# Altium schematic sheet LPDDR4 SDRAM_2.SchDoc: RK3399 COB Design V1.0
size A3; Author: ABC; Organization: Altium Limited; Address1: L3, 12a Rodborough Rd; Address2: Frenchs Forest; Address3: NSW; Address4: Australia 2086; DocumentNumber: 6; SheetNumber: 6; SheetTotal: 27; PROJECT CODE: A_V1.0
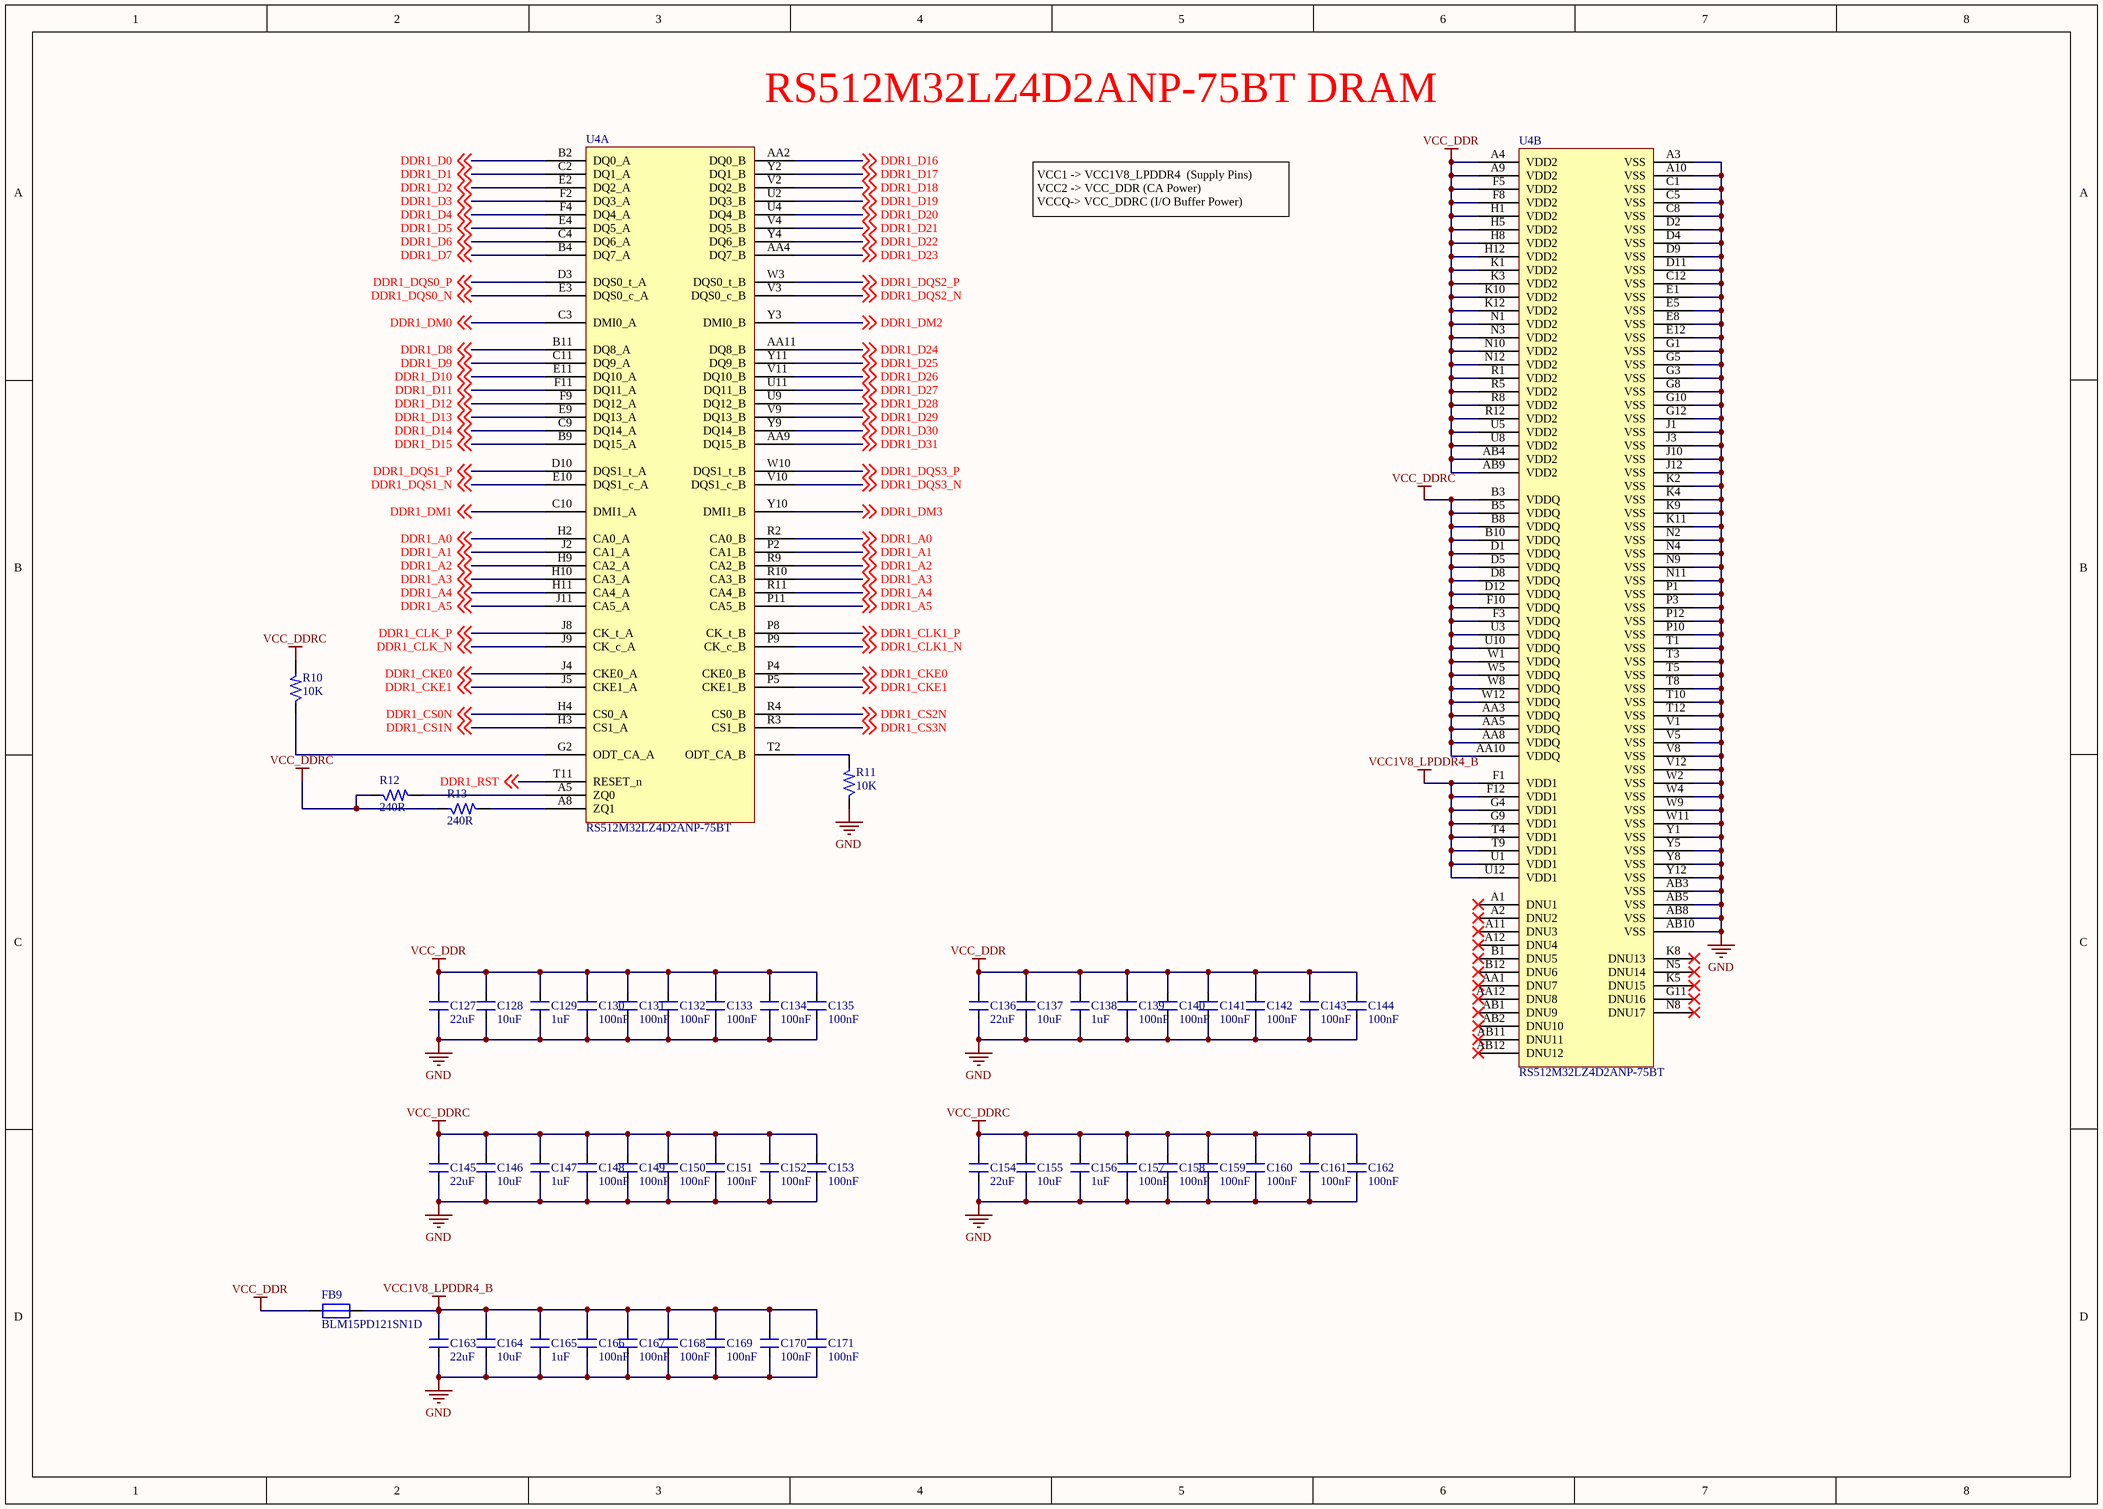
[diagram p0: LPDDR4 SDRAM_2.SchDoc]

## Parts
C127  22uF  [CAP_0402]
C128  10uF  [CAP_0402]
C129  1uF  [CAP_0201]
C130  100nF  [CAP_0201]
C131  100nF  [CAP_0201]
C132  100nF  [CAP_0201]
C133  100nF  [CAP_0201]
C134  100nF  [CAP_0201]
C135  100nF  [CAP_0201]
C136  22uF  [CAP_0402]
C137  10uF  [CAP_0402]
C138  1uF  [CAP_0201]
C139  100nF  [CAP_0201]
C140  100nF  [CAP_0201]
C141  100nF  [CAP_0201]
C142  100nF  [CAP_0201]
C143  100nF  [CAP_0201]
C144  100nF  [CAP_0201]
C145  22uF  [CAP_0402]
C146  10uF  [CAP_0402]
C147  1uF  [CAP_0201]
C148  100nF  [CAP_0201]
C149  100nF  [CAP_0201]
C150  100nF  [CAP_0201]
C151  100nF  [CAP_0201]
C152  100nF  [CAP_0201]
C153  100nF  [CAP_0201]
C154  22uF  [CAP_0402]
C155  10uF  [CAP_0402]
C156  1uF  [CAP_0201]
C157  100nF  [CAP_0201]
C158  100nF  [CAP_0201]
C159  100nF  [CAP_0201]
C160  100nF  [CAP_0201]
C161  100nF  [CAP_0201]
C162  100nF  [CAP_0201]
C163  22uF  [CAP_0402]
C164  10uF  [CAP_0402]
C165  1uF  [CAP_0201]
C166  100nF  [CAP_0201]
C167  100nF  [CAP_0201]
C168  100nF  [CAP_0201]
C169  100nF  [CAP_0201]
C170  100nF  [CAP_0201]
C171  100nF  [CAP_0201]
FB9  BLM15PD121SN1D  [RES_0402]
R10  10K  [RES_0201]
R11  10K  [RES_0201]
R12  240R  [RES_0201]
R13  240R  [RES_0201]
U4  RS512M32LZ4D2ANP-75BT  [FBGA200_SMD]  (parts A,B of 2)

## Nets
GND: C127.1 C128.1 C129.1 C130.1 C131.1 C132.1 C133.1 C134.1 C135.1 C136.1 C137.1 C138.1 C139.1 C140.1 C141.1 C142.1 C143.1 C144.1 C145.1 C146.1 C147.1 C148.1 C149.1 C150.1 C151.1 C152.1 C153.1 C154.1 C155.1 C156.1 C157.1 C158.1 C159.1 C160.1 C161.1 C162.1 C163.1 C164.1 C165.1 C166.1 C167.1 C168.1 C169.1 C170.1 C171.1 R11.1 U4.A3(VSS) U4.A10(VSS) U4.AB3(VSS) U4.AB5(VSS) U4.AB8(VSS) U4.AB10(VSS) U4.C1(VSS) U4.C5(VSS) U4.C8(VSS) U4.C12(VSS) U4.D2(VSS) U4.D4(VSS) U4.D9(VSS) U4.D11(VSS) U4.E1(VSS) U4.E5(VSS) U4.E8(VSS) U4.E12(VSS) U4.G1(VSS) U4.G3(VSS) U4.G5(VSS) U4.G8(VSS) U4.G10(VSS) U4.G12(VSS) U4.J1(VSS) U4.J3(VSS) U4.J10(VSS) U4.J12(VSS) U4.K2(VSS) U4.K4(VSS) U4.K9(VSS) U4.K11(VSS) U4.N2(VSS) U4.N4(VSS) U4.N9(VSS) U4.N11(VSS) U4.P1(VSS) U4.P3(VSS) U4.P10(VSS) U4.P12(VSS) U4.T1(VSS) U4.T3(VSS) U4.T5(VSS) U4.T8(VSS) U4.T10(VSS) U4.T12(VSS) U4.V1(VSS) U4.V5(VSS) U4.V8(VSS) U4.V12(VSS) U4.W2(VSS) U4.W4(VSS) U4.W9(VSS) U4.W11(VSS) U4.Y1(VSS) U4.Y5(VSS) U4.Y8(VSS) U4.Y12(VSS)
VCC1V8_LPDDR4_B: C163.2 C164.2 C165.2 C166.2 C167.2 C168.2 C169.2 C170.2 C171.2 FB9.2 U4.F1(VDD1) U4.F12(VDD1) U4.G4(VDD1) U4.G9(VDD1) U4.T4(VDD1) U4.T9(VDD1) U4.U1(VDD1) U4.U12(VDD1)
VCC_DDR: C127.2 C128.2 C129.2 C130.2 C131.2 C132.2 C133.2 C134.2 C135.2 C136.2 C137.2 C138.2 C139.2 C140.2 C141.2 C142.2 C143.2 C144.2 FB9.1 U4.A4(VDD2) U4.A9(VDD2) U4.AB4(VDD2) U4.AB9(VDD2) U4.F5(VDD2) U4.F8(VDD2) U4.H1(VDD2) U4.H5(VDD2) U4.H8(VDD2) U4.H12(VDD2) U4.K1(VDD2) U4.K3(VDD2) U4.K10(VDD2) U4.K12(VDD2) U4.N1(VDD2) U4.N3(VDD2) U4.N10(VDD2) U4.N12(VDD2) U4.R1(VDD2) U4.R5(VDD2) U4.R8(VDD2) U4.R12(VDD2) U4.U5(VDD2) U4.U8(VDD2)
VCC_DDRC: C145.2 C146.2 C147.2 C148.2 C149.2 C150.2 C151.2 C152.2 C153.2 C154.2 C155.2 C156.2 C157.2 C158.2 C159.2 C160.2 C161.2 C162.2 R10.2 R12.1 R13.1 U4.AA3(VDDQ) U4.AA5(VDDQ) U4.AA8(VDDQ) U4.AA10(VDDQ) U4.B3(VDDQ) U4.B5(VDDQ) U4.B8(VDDQ) U4.B10(VDDQ) U4.D1(VDDQ) U4.D5(VDDQ) U4.D8(VDDQ) U4.D12(VDDQ) U4.F3(VDDQ) U4.F10(VDDQ) U4.U3(VDDQ) U4.U10(VDDQ) U4.W1(VDDQ) U4.W5(VDDQ) U4.W8(VDDQ) U4.W12(VDDQ)
DDR1_A0: U4.H2(CA0_A) U4.R2(CA0_B) ; off-sheet DDR1_A0
DDR1_A1: U4.J2(CA1_A) U4.P2(CA1_B) ; off-sheet DDR1_A1
DDR1_A2: U4.H9(CA2_A) U4.R9(CA2_B) ; off-sheet DDR1_A2
DDR1_A3: U4.H10(CA3_A) U4.R10(CA3_B) ; off-sheet DDR1_A3
DDR1_A4: U4.H11(CA4_A) U4.R11(CA4_B) ; off-sheet DDR1_A4
DDR1_A5: U4.J11(CA5_A) U4.P11(CA5_B) ; off-sheet DDR1_A5
DDR1_CKE0: U4.J4(CKE0_A) U4.P4(CKE0_B) ; off-sheet DDR1_CKE0
DDR1_CKE1: U4.J5(CKE1_A) U4.P5(CKE1_B) ; off-sheet DDR1_CKE1
DDR1_CLK1_N: U4.P9(CK_c_B) ; off-sheet DDR1_CLK1_N
DDR1_CLK1_P: U4.P8(CK_t_B) ; off-sheet DDR1_CLK1_P
DDR1_CLK_N: U4.J9(CK_c_A) ; off-sheet DDR1_CLK_N
DDR1_CLK_P: U4.J8(CK_t_A) ; off-sheet DDR1_CLK_P
DDR1_CS0N: U4.H4(CS0_A) ; off-sheet DDR1_CS0N
DDR1_CS1N: U4.H3(CS1_A) ; off-sheet DDR1_CS1N
DDR1_CS2N: U4.R4(CS0_B) ; off-sheet DDR1_CS2N
DDR1_CS3N: U4.R3(CS1_B) ; off-sheet DDR1_CS3N
DDR1_D0: U4.B2(DQ0_A) ; off-sheet DDR1_D0
DDR1_D1: U4.C2(DQ1_A) ; off-sheet DDR1_D1
DDR1_D2: U4.E2(DQ2_A) ; off-sheet DDR1_D2
DDR1_D3: U4.F2(DQ3_A) ; off-sheet DDR1_D3
DDR1_D4: U4.F4(DQ4_A) ; off-sheet DDR1_D4
DDR1_D5: U4.E4(DQ5_A) ; off-sheet DDR1_D5
DDR1_D6: U4.C4(DQ6_A) ; off-sheet DDR1_D6
DDR1_D7: U4.B4(DQ7_A) ; off-sheet DDR1_D7
DDR1_D8: U4.B11(DQ8_A) ; off-sheet DDR1_D8
DDR1_D9: U4.C11(DQ9_A) ; off-sheet DDR1_D9
DDR1_D10: U4.E11(DQ10_A) ; off-sheet DDR1_D10
DDR1_D11: U4.F11(DQ11_A) ; off-sheet DDR1_D11
DDR1_D12: U4.F9(DQ12_A) ; off-sheet DDR1_D12
DDR1_D13: U4.E9(DQ13_A) ; off-sheet DDR1_D13
DDR1_D14: U4.C9(DQ14_A) ; off-sheet DDR1_D14
DDR1_D15: U4.B9(DQ15_A) ; off-sheet DDR1_D15
DDR1_D16: U4.AA2(DQ0_B) ; off-sheet DDR1_D16
DDR1_D17: U4.Y2(DQ1_B) ; off-sheet DDR1_D17
DDR1_D18: U4.V2(DQ2_B) ; off-sheet DDR1_D18
DDR1_D19: U4.U2(DQ3_B) ; off-sheet DDR1_D19
DDR1_D20: U4.U4(DQ4_B) ; off-sheet DDR1_D20
DDR1_D21: U4.V4(DQ5_B) ; off-sheet DDR1_D21
DDR1_D22: U4.Y4(DQ6_B) ; off-sheet DDR1_D22
DDR1_D23: U4.AA4(DQ7_B) ; off-sheet DDR1_D23
DDR1_D24: U4.AA11(DQ8_B) ; off-sheet DDR1_D24
DDR1_D25: U4.Y11(DQ9_B) ; off-sheet DDR1_D25
DDR1_D26: U4.V11(DQ10_B) ; off-sheet DDR1_D26
DDR1_D27: U4.U11(DQ11_B) ; off-sheet DDR1_D27
DDR1_D28: U4.U9(DQ12_B) ; off-sheet DDR1_D28
DDR1_D29: U4.V9(DQ13_B) ; off-sheet DDR1_D29
DDR1_D30: U4.Y9(DQ14_B) ; off-sheet DDR1_D30
DDR1_D31: U4.AA9(DQ15_B) ; off-sheet DDR1_D31
DDR1_DM0: U4.C3(DMI0_A) ; off-sheet DDR1_DM0
DDR1_DM1: U4.C10(DMI1_A) ; off-sheet DDR1_DM1
DDR1_DM2: U4.Y3(DMI0_B) ; off-sheet DDR1_DM2
DDR1_DM3: U4.Y10(DMI1_B) ; off-sheet DDR1_DM3
DDR1_DQS0_N: U4.E3(DQS0_c_A) ; off-sheet DDR1_DQS0_N
DDR1_DQS0_P: U4.D3(DQS0_t_A) ; off-sheet DDR1_DQS0_P
DDR1_DQS1_N: U4.E10(DQS1_c_A) ; off-sheet DDR1_DQS1_N
DDR1_DQS1_P: U4.D10(DQS1_t_A) ; off-sheet DDR1_DQS1_P
DDR1_DQS2_N: U4.V3(DQS0_c_B) ; off-sheet DDR1_DQS2_N
DDR1_DQS2_P: U4.W3(DQS0_t_B) ; off-sheet DDR1_DQS2_P
DDR1_DQS3_N: U4.V10(DQS1_c_B) ; off-sheet DDR1_DQS3_N
DDR1_DQS3_P: U4.W10(DQS1_t_B) ; off-sheet DDR1_DQS3_P
DDR1_RST: U4.T11(RESET_n) ; off-sheet DDR1_RST
NetR10_1: R10.1 U4.G2(ODT_CA_A)
NetR11_2: R11.2 U4.T2(ODT_CA_B)
NetR12_2: R12.2 U4.A5(ZQ0)
NetR13_2: R13.2 U4.A8(ZQ1)

Not connected (* = marked no-connect by the designer): U4 A1(DNU1)* A2(DNU2)* A11(DNU3)* A12(DNU4)* AA1(DNU7)* AA12(DNU8)* AB1(DNU9)* AB2(DNU10)* AB11(DNU11)* AB12(DNU12)* B1(DNU5)* B12(DNU6)* G11(DNU16)* K5(DNU15)* K8(DNU13)* N5(DNU14)* N8(DNU17)*

## Notes on the sheet
- (near U4) RS512M32LZ4D2ANP-75BT DRAM
- VCC1 -> VCC1V8_LPDDR4  (Supply Pins)
  VCC2 -> VCC_DDR (CA Power)
  VCCQ-> VCC_DDRC (I/O Buffer Power)
- TITLE:
- DOCUMENT NAME:
- SCALE 1:1
- This document is copyright of Esteempcb and shall not be revealed, produced, copied, in whole or in part, nor
- PROJECT CODE:
- TEMPLATE:
- A3
- AUTHOR:
- Sheet
- of
- used for any purpose other than submitted.

## Library data of the parts
C127 C136 C145 C154 C163 = CAP_22uF-6.3V-20%-0402: 22µF ±20% 6.3V Ceramic Capacitor X5R 0402 (1005 Metric) /; Manufacturer: Murata Electronics; Manufacturer Part Number: CL05A226MQ5N6J8; Case/Package: 0402; Supplier-1: Digikey
C128 C137 C146 C155 C164 = CAP_10uF-10V-20%-0402: 10µF ±20% 10V Ceramic Capacitor X5R 0402 (1005 Metric) /; Manufacturer Part Number: CL05A106MP5NUNC; Manufacturer: Samsung Electro-Mechanics; Case/Package: 0402; Supplier-1: Digikey
C129 C138 C147 C156 C165 = CAP_1uF-16V-10%-0201: 1µF ±20% 16V Ceramic Capacitor X5R 0201 (0603 Metric) /; Manufacturer: Samsung Electro-Mechanics; Manufacturer Part Number: CL03A105MO3NRNH; Case/Package: 0201; Supplier-1: Digikey
C130-C135 C139-C144 C148-C153 C157-C162 C166-C171 = CAP_100nF-25V-10%-0201: 0.1µF ±10% 25V Ceramic Capacitor X5R 0201 (0603 Metric) /; Manufacturer: TDK Corporation; Manufacturer Part Number: C0603X5R1E104K030BB; Case/Package: 0201; Supplier-1: Digikey
FB9 = FB_120R-1.3A-100Mhz-0402: 120 Ohms @ 100MHz 1 Power Line Ferrite Bead 0402 (1005 Metric) 1.3A 90mOhm; Manufacturer: Murata Electronics; Mnaufacturer Part Number: BLM15PD121SN1D; Case/Package: 0402; Supplier-1: Digikey
R10 R11 = RES_10K-0.05W-1%-0201: 10 kOhms ±1% 0.05W, 1/20W Chip Resistor 0201 (0603 Metric) Thick Film /; Manufacturer: Stackpole Electronics Inc; Manufacturer Part Number: RMCF0201FT10K0; Case/Package: 0201; Supplier-1: Digikey
R12 R13 = RES_240R-0.05W-1%-0201: 240 Ohms ±1% 0.05W, 1/20W Chip Resistor 0201 (0603 Metric) Thick Film /; Manufacturer: Yageo; Manufacturer Part Number: RC0201FR-07240RL; Case/Package: 0201; Supplier-1: Digikey
U4 = IC_RS512M32LZ4D2ANP-75BT: LPDDR4/4X Package FBGA 200b Density 4Gbit~64Gbit Operating Temperature Range：-25~85℃ Speed：2667Mbps/3200Mbps/3733Mbps Voltage：VDD1/VDD2/VDDQ= 1.8 / 1.1 / 1.1 V（LPDDR4）VDD1/VDD2/VDDQ = 1.8 / 1.1 / 0.6 V（LPDDR4X）Approved Verification Platform：MTK、Spreadtrum; Manufacturer: RAYSON; Manufacturer Part Number: RS512M32LZ4D2ANP-75BT; Case/Package: FBGA 200b; Supplier-1: RAYSON